# Altium schematic sheet MAZ000186 - Diagrama eléctrico.SchDoc: MAZ000186 - Diagrama eléctrico
size A; ApprovedBy: Christian Ledwidth; CheckedBy: Nahuel Martinez; Author: Santiago Marti; CompanyName: Body Health; DrawnBy: Santiago Marti; Revision: A; SheetNumber: 1; SheetTotal: 2
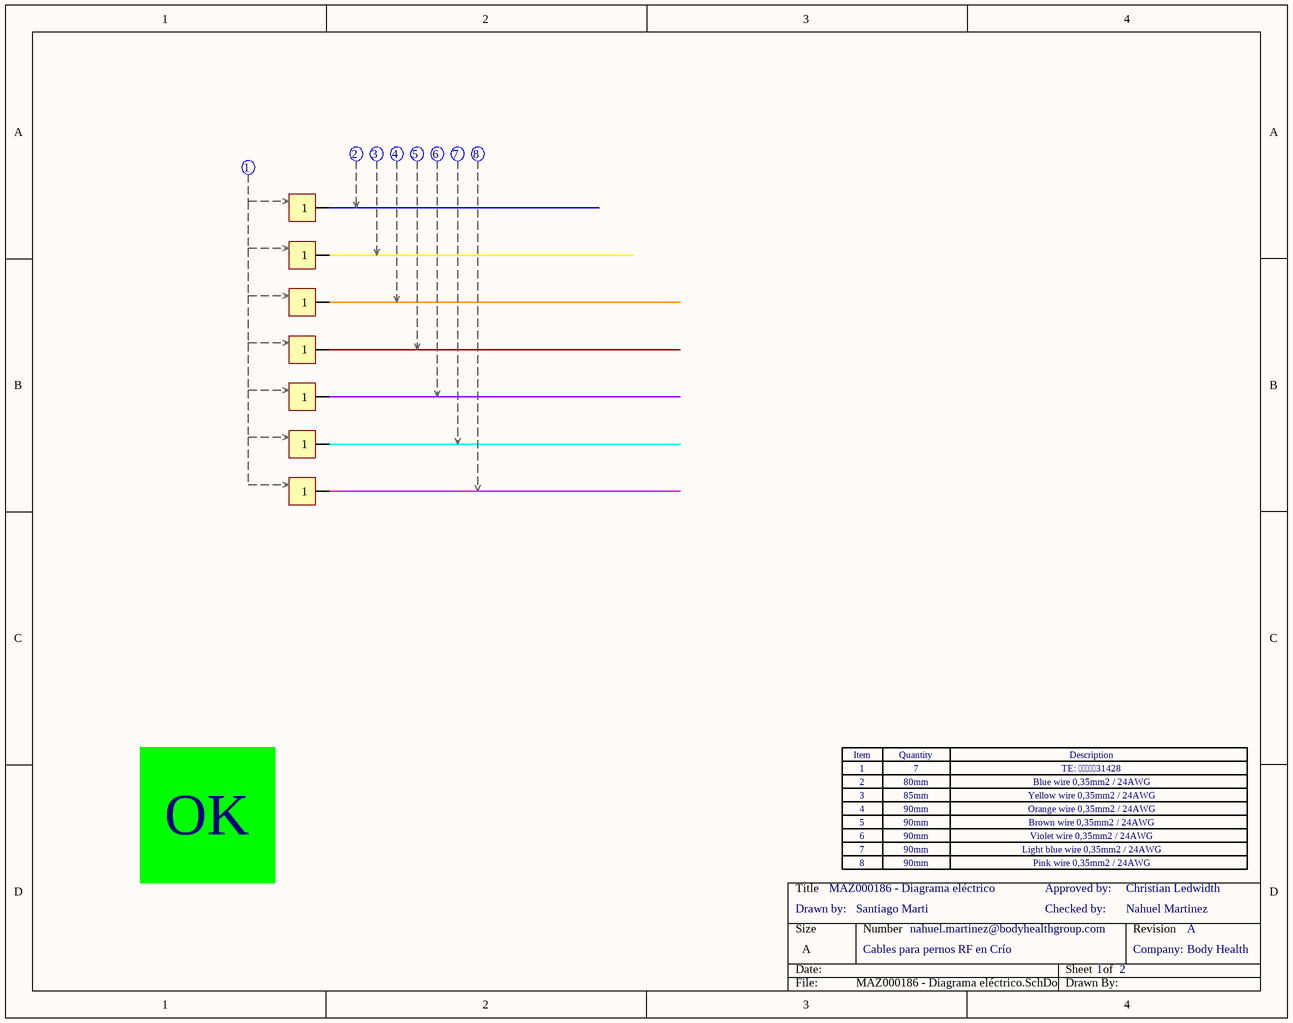
[diagram p0: MAZ000186 - Diagrama eléctrico.SchDoc]

## Parts
(Parts that share a designator on the sheet are numbered #1, #2 ... from top to bottom, then left to right.)
Con?#1  Ring  (value not drawn)  (part D of 4)
Con?#2  Ring  (value not drawn)  (part D of 4)
Con?#3  Ring  (value not drawn)  (part D of 4)
Con?#4  Ring  (value not drawn)  (part D of 4)
Con?#5  Ring  (value not drawn)  (part D of 4)
Con?#6  Ring  (value not drawn)  (part D of 4)
Con?#7  Ring  (value not drawn)  (part D of 4)
Ter?#1  Termocontraible  (value not drawn)
Ter?#2  Termocontraible  (value not drawn)
Ter?#3  Termocontraible  (value not drawn)
Ter?#4  Termocontraible  (value not drawn)
Ter?#5  Termocontraible  (value not drawn)
Ter?#6  Termocontraible  (value not drawn)
Ter?#7  Termocontraible  (value not drawn)
Ter?#8  Termocontraible  (value not drawn)
Zoc1  Zócalo_Header  (value not drawn)
Zoc2  Zócalo_Item  (value not drawn)
Zoc3  Zócalo_Item  (value not drawn)
Zoc4  Zócalo_Item  (value not drawn)
Zoc5  Zócalo_Item  (value not drawn)
Zoc?#1  Zócalo_Item  (value not drawn)
Zoc?#2  Zócalo_Item  (value not drawn)
Zoc?#3  Zócalo_Item  (value not drawn)
Zoc?#4  Zócalo_Item  (value not drawn)

## Nets

Not connected (* = marked no-connect by the designer): Con?#1 1; Con?#2 1; Con?#3 1; Con?#4 1; Con?#5 1; Con?#6 1; Con?#7 1

## Notes on the sheet
- 1
- 2
- 7
- 80mm
- TE: 31428
- Blue wire 0,35mm2 / 24AWG
- OK
- 3
- 4
- 5
- (near Zoc?#1) 6
- 85mm
- 90mm
- Yellow wire 0,35mm2 / 24AWG
- Orange wire 0,35mm2 / 24AWG
- Brown wire 0,35mm2 / 24AWG
- Violet wire 0,35mm2 / 24AWG
- (near Zoc?#4) Drawn by:
- (near Zoc?#2) 7
- (near Zoc?#3) 8
- Checked by:
- Approved by:
- Light blue wire 0,35mm2 / 24AWG
- Pink wire 0,35mm2 / 24AWG
- Cables para pernos RF en Crío
- nahuel.martinez@bodyhealthgroup.com
- Company:
- (in symbol Zócalo_Header) Item; Quantity; Description

## Library data of the parts
Con?#1-Con?#7 = Ring: CONN HOUSING RING M4; Cod.DigiKey: -; Cod.Fabricante: -; ComponentLink1Description: Manufacturer Link; ComponentLink1URL: -; DIGIKEYx50: -; Fabricante: -; CallOut: *; DIGIKEYx100: -
Ter?#1 = Termocontraible: CallOut: 2; Largo: *; Diámetro: *
Ter?#2 = Termocontraible: CallOut: 3; Largo: *; Diámetro: *
Ter?#3 = Termocontraible: CallOut: 4; Largo: *; Diámetro: *
Ter?#4 = Termocontraible: CallOut: 5; Largo: *; Diámetro: *
Ter?#5 = Termocontraible: CallOut: 6; Largo: *; Diámetro: *
Ter?#6 = Termocontraible: CallOut: 7; Largo: *; Diámetro: *
Ter?#7 = Termocontraible: CallOut: 8; Largo: *; Diámetro: *
Ter?#8 = Termocontraible: CallOut: 1; Largo: *; Diámetro: *
Zoc1 = Zócalo_Header: Header para el zócalo de referencias
Zoc2-Zoc5 Zoc?#1-Zoc?#4 = Zócalo_Item: Ítem para el zócalo de referencias; Desginator: *; Quantity: *; ItemDescription: *